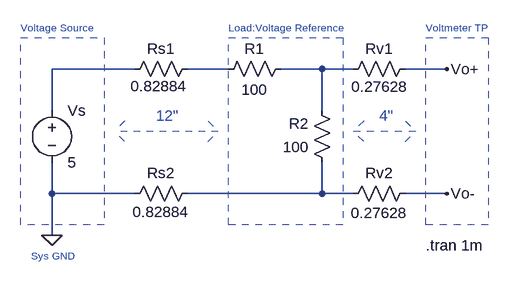
[diagram p0: schematic Lab 2 Experiment 1.asc]
Lab 2 Experiment 1.asc, the LTspice schematic file:
Version 4
SHEET 1 880 680
WIRE -64 48 -192 48
WIRE 80 48 16 48
WIRE 224 48 160 48
WIRE 272 48 224 48
WIRE 416 48 352 48
WIRE -192 112 -192 48
WIRE 224 112 224 48
WIRE -192 240 -192 192
WIRE -64 240 -192 240
WIRE 224 240 224 192
WIRE 224 240 16 240
WIRE 272 240 224 240
WIRE 416 240 352 240
WIRE -192 304 -192 240
FLAG -192 304 0
FLAG 416 48 Vo+
FLAG 416 240 Vo-
DATAFLAG -176 48 ""
SYMBOL voltage -192 96 R0
WINDOW 123 0 0 Left 0
WINDOW 39 0 0 Left 0
SYMATTR InstName Vs
SYMATTR Value 5
SYMBOL res 176 32 R90
WINDOW 0 0 56 VBottom 2
WINDOW 3 32 56 VTop 2
SYMATTR InstName R1
SYMATTR Value 100
SYMBOL res 240 208 R180
WINDOW 0 36 76 Left 2
WINDOW 3 36 40 Left 2
SYMATTR InstName R2
SYMATTR Value 100
SYMBOL res 32 32 R90
WINDOW 0 0 56 VBottom 2
WINDOW 3 58 59 VBottom 2
SYMATTR InstName Rs1
SYMATTR Value 0.82884
SYMBOL res 368 32 R90
WINDOW 0 0 56 VBottom 2
WINDOW 3 59 55 VBottom 2
SYMATTR InstName Rv1
SYMATTR Value 0.27628
SYMBOL res 32 224 R90
WINDOW 0 0 56 VBottom 2
WINDOW 3 60 56 VBottom 2
SYMATTR InstName Rs2
SYMATTR Value 0.82884
SYMBOL res 368 224 R90
WINDOW 0 0 56 VBottom 2
WINDOW 3 61 56 VBottom 2
SYMATTR InstName Rv2
SYMATTR Value 0.27628
TEXT 384 320 Left 2 !.tran 1m
TEXT -32 120 Left 2 ;12"
TEXT 312 120 Left 2 ;4"
TEXT 80 -16 Left 1 ;Load:Voltage Reference
TEXT -240 -16 Left 1 ;Voltage Source
TEXT 384 -16 Left 1 ;Voltmeter TP
TEXT -224 336 Left 1 ;Sys GND
LINE Normal 64 144 -96 144 2
LINE Normal -80 128 -96 144 2
LINE Normal -80 160 -96 144 2
LINE Normal 48 128 64 144 2
LINE Normal 48 160 64 144 2
LINE Normal 368 144 272 144 2
LINE Normal 288 128 272 144 2
LINE Normal 288 160 272 144 2
LINE Normal 352 128 368 144 2
LINE Normal 352 160 368 144 2
RECTANGLE Normal 256 288 80 0 2
RECTANGLE Normal -112 288 -240 0 2
RECTANGLE Normal 480 288 384 0 2

The netlist it stands for:
* Lab 2 Experiment 1.asc
Vs N001 0 5
R1 N003 N002 100
R2 N004 N003 100
Rs1 N002 N001 0.82884
Rv1 Vo+ N003 0.27628
Rs2 N004 0 0.82884
Rv2 Vo- N004 0.27628
.tran 1m
* 12"
* 4"
* Load:Voltage Reference
* Voltage Source
* Voltmeter TP
* Sys GND
.backanno
.end